# EAGLE design tda7384sch (EAGLE 4.15)
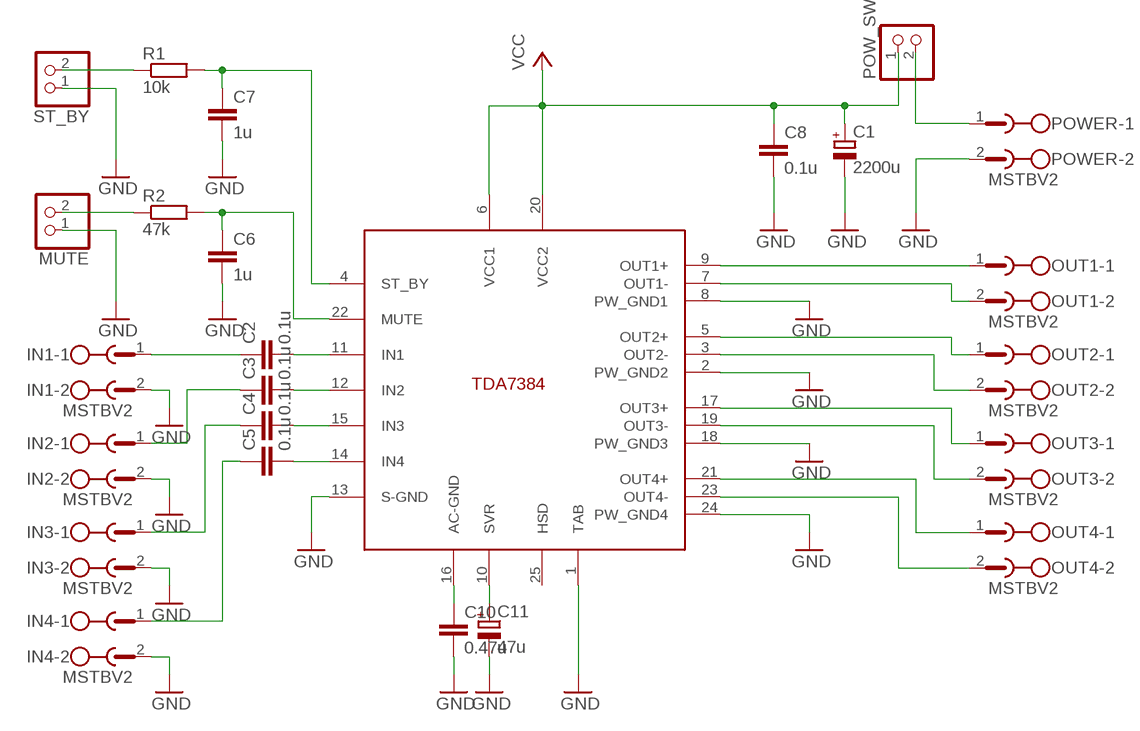
[diagram p0: schematic, sheet 1]

## Parts
C1  2200u  CPOL-EUE7.5-16  [E7,5-16]
C2  0.1u  C-EU050-055X075  [C050-055X075]
C3  0.1u  C-EU050-055X075  [C050-055X075]
C4  0.1u  C-EU050-055X075  [C050-055X075]
C5  0.1u  C-EU050-055X075  [C050-055X075]
C6  1u  C-EU050-055X075  [C050-055X075]
C7  1u  C-EU050-055X075  [C050-055X075]
C8  0.1u  C-EU050-055X075  [C050-055X075]
C10  0.47u  C-EU050-055X075  [C050-055X075]
C11  47u  CPOL-EUE2.5-5  [E2,5-5]
IN1  MSTBV2  [MSTBV2]
IN2  MSTBV2  [MSTBV2]
IN3  MSTBV2  [MSTBV2]
IN4  MSTBV2  [MSTBV2]
MUTE  PINHD-1X2  [1X02]
OUT1  MSTBV2  [MSTBV2]
OUT2  MSTBV2  [MSTBV2]
OUT3  MSTBV2  [MSTBV2]
OUT4  MSTBV2  [MSTBV2]
POW_SW  PINHD-1X2  [1X02]
POWER  MSTBV2  [MSTBV2]
R1  10k  R-EU_0207/10  [0207/10]
R2  47k  R-EU_0207/10  [0207/10]
ST_BY  PINHD-1X2  [1X02]
U$1  TDA7384  [FLEXIWATT25]

## Nets
GND: C1.- C6.2 C7.2 C8.2 C10.2 C11.- IN1.2 IN2.2 IN3.2 IN4.2 MUTE.1 POWER.2 ST_BY.1 U$1.1(TAB) U$1.2(PW_GND2) U$1.8(PW_GND1) U$1.13(S-GND) U$1.18(PW_GND3) U$1.24(PW_GND4)
N$1: C7.1 R1.2 U$1.4(ST_BY)
N$2: C6.1 R2.2 U$1.22(MUTE)
N$3: MUTE.2 R2.1
N$4: R1.1 ST_BY.2
N$5: C2.2 U$1.11(IN1)
N$6: C3.2 U$1.12(IN2)
N$7: C4.2 U$1.15(IN3)
N$8: C5.2 U$1.14(IN4)
N$9: C2.1 IN1.1
N$10: C3.1 IN2.1
N$11: C4.1 IN3.1
N$12: C5.1 IN4.1
N$13: C10.1 U$1.16(AC-GND)
N$14: C11.+ U$1.10(SVR)
N$15: POW_SW.2 POWER.1
N$16: OUT1.1 U$1.9(OUT1+)
N$17: OUT1.2 U$1.7(OUT1-)
N$18: OUT2.1 U$1.5(OUT2+)
N$19: OUT2.2 U$1.3(OUT2-)
N$20: OUT3.1 U$1.17(OUT3+)
N$21: OUT3.2 U$1.19(OUT3-)
N$22: OUT4.1 U$1.21(OUT4+)
N$23: OUT4.2 U$1.23(OUT4-)
VCC: C1.+ C8.1 POW_SW.1 U$1.6(VCC1) U$1.20(VCC2)
Unconnected: U$1.25(HSD)

## Library data of the parts
C1 C11 = rcl:CPOL-EU: POLARIZED CAPACITOR, European symbol
C2-C8 C10 = rcl:C-EU: CAPACITOR, European symbol
IN1-IN4 OUT1-OUT4 POWER = con-phoenix-508:MSTBV2: PHOENIX
MUTE POW_SW ST_BY = pinhead:PINHD-1X2: PIN HEADER
R1 R2 = rcl:R-EU_: RESISTOR, European symbol
U$1 = TDA7384:TDA7384

## Board
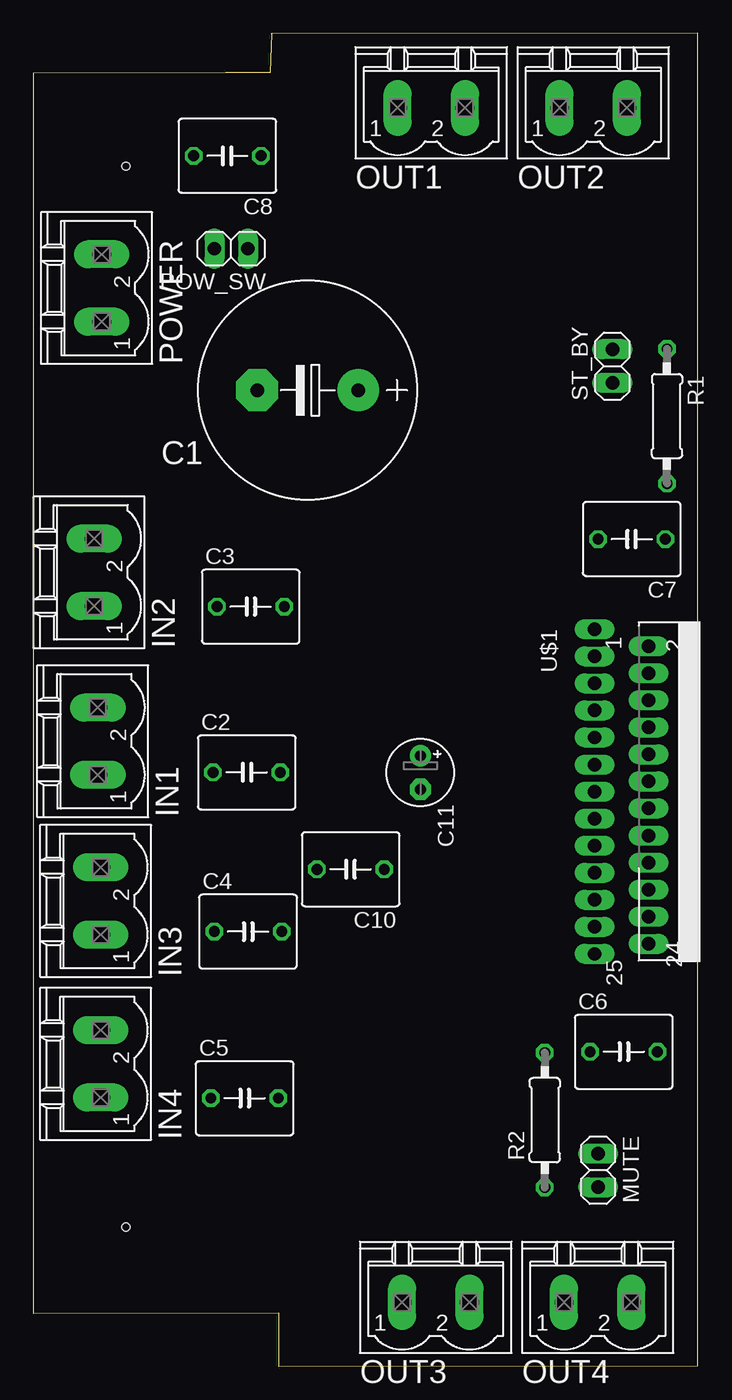
[diagram p1: board, top side]
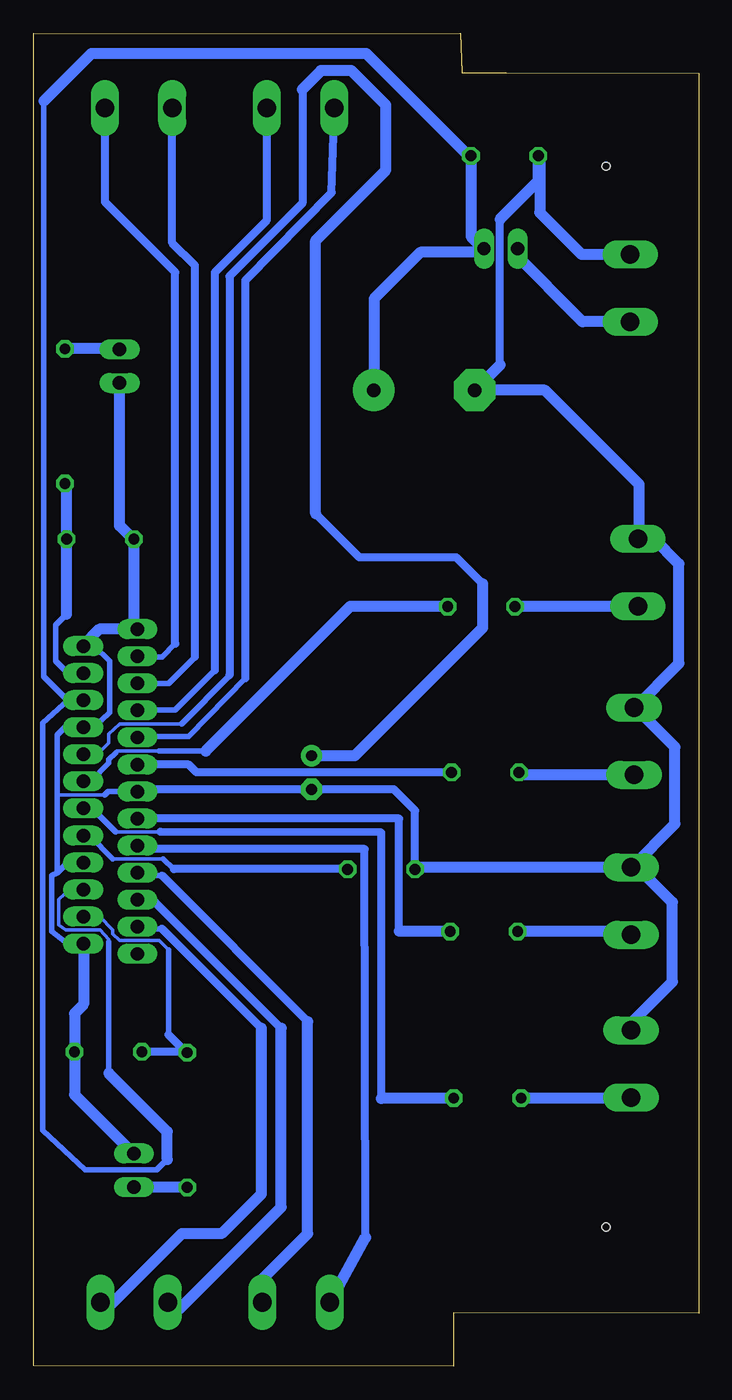
[diagram p2: board, bottom side, seen from below]

Size 50.15 x 100.53 mm. Coordinates in mm from the lower left corner, seen from the top.
Outline: 50.15,0.03 50.15,100.53 18,100.5 18,100.53 17.87,97.53 14.5,97.53 0,97.5 0,4 18.5,4.03 18.5,0 50.15,0.03
Copper layers (1*16): Top 0.035mm / dielectric 1.5mm / Bottom 0.035mm
Design rules "default": minimum track width 10mil, minimum drill 24mil, track to track 8mil, track to pad 8mil, pad to pad 8mil, via to via 8mil, smd to smd 8mil, copper to edge 40mil, drill to drill 8mil, minimum pad ring 10mil, minimum via ring 8mil, stop-mask expansion 4mil, vias tented up to drill 0mil, thermal gap 10mil
Holes 0.6 mm at 7,10.5 7,90.5

### Footprints (pad centres in the part's own frame; a part is rotated, then mirrored left to right if it is on the bottom)
E7,5-16 = drill 1.016 pad 3.15 round: + -3.81,0 | drill 1.016 pad 3.15 octagon: - 3.81,0
C050-055X075 = drill 0.813 octagon: 1 -2.54,0; 2 2.54,0
E2,5-5 = drill 0.813 pad 1.6 round: + -1.27,0 | drill 0.813 pad 1.6 octagon: - 1.27,0
MSTBV2 = drill 1.397 long: 1 -2.54,0; 2 2.54,0
1X02 = drill 1.016 long: 1 -1.27,0; 2 1.27,0
0207/10 = drill 0.813 octagon: 1 -5.08,0; 2 5.08,0
FLEXIWATT25 = drill 1.016 pad 1.27 long: 1 -16.51,-1.54; 2 -15.24,2.54; 3 -14.47,-1.54; 4 -13.2,2.54; 5 -12.43,-1.54; 6 -11.16,2.54; 7 -10.39,-1.54; 8 -9.12,2.54; 9 -8.35,-1.54; 10 -7.08,2.54; 11 -6.31,-1.54; 12 -5.04,2.54; 13 -4.27,-1.54; 14 -3,2.54; 15 -2.23,-1.54; 16 -0.96,2.54; 17 -0.19,-1.54; 18 1.08,2.54; 19 1.85,-1.54; 20 3.12,2.54; 21 3.89,-1.54; 22 5.16,2.54; 23 5.93,-1.54; 24 7.2,2.54; 25 7.97,-1.54

### Placement (x,y rotation side)
C1  20.71,73.61 180 top
C2  16.11,44.79 0 top
C3  16.41,57.29 0 top
C4  16.21,32.79 0 top
C5  15.95,20.22 0 top
C6  44.55,23.72 0 top
C7  45.15,62.38 180 top
C8  14.65,91.28 180 top
C10  23.95,37.48 180 top
C11  29.21,44.78 270 top
IN1  4.88,47.14 90 top
IN2  4.6,59.87 90 top
IN3  5.1,35.09 90 top
IN4  5.1,22.81 90 top
MUTE  42.62,14.78 270 top
OUT1  30.03,94.9 0 top
OUT2  42.25,94.9 0 top
OUT3  30.37,4.83 0 top
OUT4  42.59,4.83 0 top
POW_SW  14.94,84.28 180 top
POWER  5.17,81.31 90 top
R1  47.81,71.65 270 top
R2  38.59,18.57 90 top
ST_BY  43.69,75.42 90 top
U$1  43.89,39.07 270 top

### Tracks (layer width: path | path; a pad name or v marks a point on that pad's centre or on a via)
GND
  Bottom 0.254: 44.8,43.1 48.4,43.1
  Bottom 0.406: 12,91.5 12.11,91.39 C8.2 | 17,73.5 C1.- | 4.5,62.5 IN2.2 3.41,62.41 | IN1.2 4.88,49.62 5,49.5 4.6,49.5 | 4.63,37.63 IN3.2 5.07,37.63 | 5.5,25.5 5.35,25.35 IN4.2 | U$1.24 46.43,31.97 46.4,32 47.8,32 48.8,32.8 48.8,37 48.4,37.2 | 42.6,16 42.62,16.02 MUTE.1 | 42.6,62.3 42.61,62.31 C7.2 | U$1.1 42.35,55.65 42.6,55.9 | U$1.2 46.49,54.31 46.5,54.3 45.6,54.3 44.45,53.2 44.45,49.3 45.6,48.2 46.4,48.2 46.41,48.19 U$1.8 46.49,48.19 46.5,48.2 47.8,48.2 48.4,47.6 48.4,43.1 48.4,37.2 | 48.4,37.2 47.5,38.1 46.5,38.1 46.43,38.03 U$1.18 | U$1.13 42.4,43.3 | U$1.13 44.56,43.34 44.8,43.1 | 42.19,43.51 U$1.13 | C10.2 21.27,37.63 | 26.4,43.5 26.41,43.51
  Bottom 0.61: 15,75.5 15,86.5 | 26.41,43.51 C11.- 42.19,43.51 | C10.2 21.41,41.91 23,43.5 26.4,43.5
  Bottom 0.813: POWER.2 8.85,83.85 12,87 12,91.5 | C8.2 12.11,89.39 15,86.5 | C1.- 15,75.5 | C1.- 11.61,73.61 4.5,66.5 4.5,62.5 | 3.41,62.41 1.5,60.5 1.5,53 4.88,49.62 | 4.63,37.63 2,35 2,29 5.5,25.5 | 46.4,32 46.4,27.3 47.09,26.61 C6.2 47.09,20.49 42.62,16.02 | ST_BY.1 43.69,63.39 42.61,62.31 | 42.6,55.9 42.6,62.3 | U$1.1 45.22,55.58 46.49,54.31 | 4.6,49.5 1.8,46.7 1.8,40.9 5.07,37.63 | IN3.2 21.27,37.63
N$1
  Bottom 0.406: 47.69,56.71 48.5,55.9 48.5,53.2 47.6,52.3 46.5,52.3 46.47,52.27 U$1.4 | R1.2 47.77,66.57 47.69,66.49
  Bottom 0.813: 47.69,56.71 C7.1 47.69,66.49
N$2
  Bottom 0.254: 45.61,33.91 45.21,33.91 44.2,32.9 44.2,32.6 43.7,32.1 40.7,32.1 40,31.4
  Bottom 0.406: 45.61,33.91 U$1.22 | 42,23.7 C6.1 | 38.62,23.72 38.59,23.69 R2.2 38.59,23.61 38.6,23.6 | 40,25 40,31.4
  Bottom 0.61: 38.62,23.72 C6.1 | 38.6,23.6 40,25
N$3
  Bottom 0.406: R2.1 38.51,13.49 38.5,13.5 38.51,13.51
  Bottom 0.813: 38.51,13.51 MUTE.2
N$4
  Bottom 0.406: ST_BY.2 43.51,76.69 43.5,76.7 43.53,76.73
  Bottom 0.813: 43.53,76.73 R1.1
N$5
  Bottom 0.406: 18.6,44.8 18.61,44.79 C2.2
  Bottom 0.61: U$1.11 38.48,45.38 37.9,44.8 18.6,44.8
N$6
  Bottom 0.254: 44,46.25 44,46.3 43.9,46.4 40.7,46.4
  Bottom 0.406: U$1.12 45.89,44.11 44.5,45.5 44.5,45.75 44,46.25 | 37.2,46.4 40.7,46.4 | 19,57.3 18.99,57.29 C3.2
  Bottom 0.813: 37.2,46.4 26.3,57.3 19,57.3
N$7
  Bottom 0.406: 18.75,32.75 18.7,32.7 | C4.2 18.75,32.75 | 18.75,32.75 18.8,32.8
  Bottom 0.61: U$1.15 22.6,41.3 22.6,32.8
  Bottom 0.813: 18.8,32.8 22.6,32.8
N$8
  Bottom 0.254: 40.6,40.3 44,40.3
  Bottom 0.406: U$1.14 45.77,42.07 44,40.3 | C5.2 18.49,20.29 18.5,20.3 18.6,20.2
  Bottom 0.61: 40.6,40.3 23.95,40.25 23.95,20.2
  Bottom 0.813: 18.6,20.2 23.95,20.2
N$9
  Bottom 0.406: C2.1 13.57,44.57 13.5,44.5 13.4,44.6
  Bottom 0.813: IN1.1 13.4,44.6
N$10
  Bottom 0.406: IN2.1 4.83,57.33 5,57.5 5.21,57.29
  Bottom 0.813: 5.21,57.29 C3.1
N$11
  Bottom 0.406: 5.05,32.55 5,32.5 | IN3.1 5.05,32.55 | 5.05,32.55 5.29,32.79
  Bottom 0.813: 5.29,32.79 C4.1
N$12
  Bottom 0.406: 5.1,20.4 5,20.5 | IN4.1 5.1,20.4 | 5.1,20.4 5.28,20.22
  Bottom 0.813: 5.28,20.22 C5.1
N$13
  Bottom 0.254: 40.4,38.25 44.2,38.25
  Bottom 0.406: U$1.16 45.93,40.03 44.2,38.25 | 39.6,37.5 40.4,38.25 | 26.5,37.5 C10.1
  Bottom 0.61: 26.5,37.5 39.6,37.5
N$14
  Bottom 0.254: 39,48.45 43.7,48.45 44.5,47.7 44.5,47 45.7,45.8 46.1,45.8 46.43,46.13 U$1.10
  Bottom 0.406: 35.4,52.1 39,48.45
  Bottom 0.61: 16.3,59 18.3,61 25.6,61 28.9,64.3 | 29.9,96.3 29.9,87.7 35.4,82.2 35.4,52.1
  Bottom 0.813: C11.+ 25.95,46.05 16.3,55.7 16.3,59 | 28.9,64.3 28.9,84.9 23.6,90.2 23.6,95.1 26.2,97.7 28.5,97.7 29.9,96.3
N$15
  Bottom 0.406: 14,84 13.72,84.28 POW_SW.2
  Bottom 0.813: POWER.1 8.77,78.77 14,84
N$16
  Bottom 0.406: 34.2,51.9 38.5,47.5 42.5,47.5 42.42,47.42 U$1.9
  Bottom 0.61: OUT1.1 27.69,88.51 34.2,81.9 34.2,51.9
N$17
  Bottom 0.406: 36.5,52.5 39.5,49.5 42,49.5 42.35,49.15 | 42.35,49.15 42.5,49 | 42.35,49.15 U$1.7
  Bottom 0.61: OUT1.2 32.57,86.43 36.5,82.5 36.5,52.5
N$18
  Bottom 0.406: 38,53.5 40,51.5 U$1.5 42.5,51.5
  Bottom 0.61: OUT2.1 39.71,84.71 38,83 38,53.5
N$19
  Bottom 0.406: 39.5,54.5 40.5,53.5 42.5,53.5 42.46,53.54 U$1.3
  Bottom 0.61: OUT2.2 44.79,87.79 39.5,82.5 39.5,54.5
N$20
  Bottom 0.406: 42,39 42.26,39.26 U$1.17
  Bottom 0.61: 25.13,9.73 25.2,39 42,39
  Bottom 0.813: OUT3.1 25.13,9.73
N$21
  Bottom 0.406: U$1.19 42.35,37.15 42.5,37 40.5,37
  Bottom 0.61: 29.5,26 40.5,37
  Bottom 0.813: OUT3.2 32.91,6.59 29.5,10 29.5,26
N$22
  Bottom 0.406: OUT4.1 39.17,4.33 | U$1.21 42.35,35.15 42.5,35 41,35
  Bottom 0.61: 31.5,25.5 41,35
  Bottom 0.813: 39.17,4.33 31.5,12 31.5,25.5
N$23
  Bottom 0.406: 44.67,4.33 OUT4.2 | U$1.23 42.5,33 40.5,33
  Bottom 0.61: 33,25.5 40.5,33
  Bottom 0.813: 44.67,4.33 39,10 36,10 33,13 33,25.5
VCC
  Bottom 0.254: 44.5,32 44.5,32.2 45.15,32.9 47.75,32.9 48.3,33.3 48.3,35.2 47.4,36 46.6,36 46.5,35.9 46.45,35.95 U$1.20
  Bottom 0.406: 16,84 16.21,84.21 POW_SW.1 | 24.5,73.5 24.52,73.52 C1.+ | 49.4,95.4 49.4,52 47.63,50.23 U$1.6 47.57,50.23 49.5,48.5 49.5,17.8 46.3,14.8 40.9,14.8 40.1,15.6 | 17.2,91.1 17.19,91.11 C8.1 | 44.5,22.1 44.5,32
  Bottom 0.813: C8.1 17.19,85.19 16.21,84.21 | 16,84 21,84 24.5,80.5 24.5,73.5 | 49.4,95.4 45.8,99 25.1,99 17.2,91.1 | 40.1,15.6 40.1,17.7 44.5,22.1